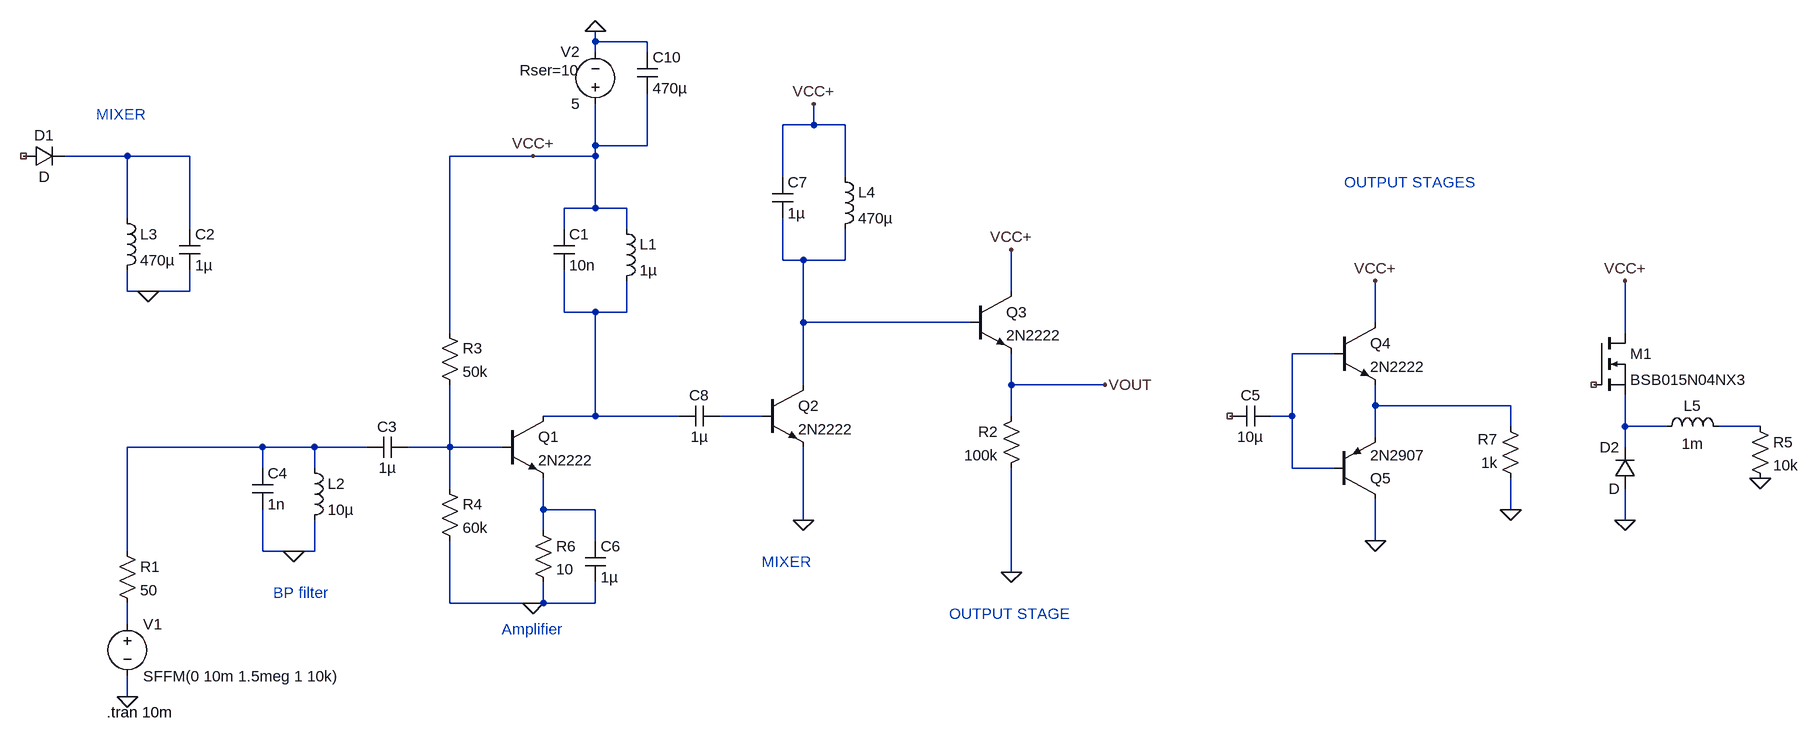
[diagram p0: schematic slope-detector.asc]
slope-detector.asc, the LTspice schematic file:
Version 4
SHEET 1 2260 888
WIRE 192 -608 192 -624
WIRE 272 -608 192 -608
WIRE 192 -592 192 -608
WIRE 272 -592 272 -608
WIRE 528 -480 528 -512
WIRE 528 -480 480 -480
WIRE 576 -480 528 -480
WIRE 192 -448 192 -512
WIRE 272 -448 272 -528
WIRE 272 -448 192 -448
WIRE -528 -432 -624 -432
WIRE -432 -432 -528 -432
WIRE 96 -432 -32 -432
WIRE 192 -432 192 -448
WIRE 192 -432 96 -432
WIRE 480 -400 480 -480
WIRE 576 -400 576 -480
WIRE 192 -352 192 -432
WIRE 192 -352 144 -352
WIRE 240 -352 192 -352
WIRE -528 -336 -528 -432
WIRE -432 -320 -432 -432
WIRE 144 -320 144 -352
WIRE 240 -320 240 -352
WIRE 480 -272 480 -336
WIRE 512 -272 480 -272
WIRE 576 -272 576 -320
WIRE 576 -272 512 -272
WIRE -528 -224 -528 -256
WIRE -496 -224 -528 -224
WIRE -432 -224 -432 -256
WIRE -432 -224 -496 -224
WIRE 832 -224 832 -288
WIRE 144 -192 144 -256
WIRE 192 -192 144 -192
WIRE 240 -192 240 -240
WIRE 240 -192 192 -192
WIRE 512 -176 512 -272
WIRE 768 -176 512 -176
WIRE 1392 -176 1392 -240
WIRE -32 -160 -32 -432
WIRE 1776 -160 1776 -240
WIRE 1328 -128 1264 -128
WIRE 512 -80 512 -176
WIRE 832 -80 832 -128
WIRE 976 -80 832 -80
WIRE 1392 -48 1392 -80
WIRE 1600 -48 1392 -48
WIRE 192 -32 192 -192
WIRE 192 -32 112 -32
WIRE 320 -32 192 -32
WIRE 448 -32 384 -32
WIRE 832 -32 832 -80
WIRE 1264 -32 1264 -128
WIRE 1264 -32 1232 -32
WIRE 1600 -16 1600 -48
WIRE 1776 -16 1776 -64
WIRE 1840 -16 1776 -16
WIRE 1984 -16 1920 -16
WIRE 1392 0 1392 -48
WIRE -320 16 -528 16
WIRE -240 16 -320 16
WIRE -160 16 -240 16
WIRE -32 16 -32 -80
WIRE -32 16 -96 16
WIRE 48 16 -32 16
WIRE 1776 16 1776 -16
WIRE -320 48 -320 16
WIRE -240 48 -240 16
WIRE 1264 48 1264 -32
WIRE 1328 48 1264 48
WIRE -32 80 -32 16
WIRE 112 112 112 64
WIRE 192 112 112 112
WIRE 1600 112 1600 64
WIRE 512 128 512 16
WIRE 1776 128 1776 80
WIRE 112 144 112 112
WIRE 192 160 192 112
WIRE 1392 160 1392 96
WIRE -528 176 -528 16
WIRE -320 176 -320 112
WIRE -272 176 -320 176
WIRE -240 176 -240 128
WIRE -240 176 -272 176
WIRE 832 208 832 48
WIRE -32 256 -32 160
WIRE 96 256 -32 256
WIRE 112 256 112 224
WIRE 112 256 96 256
WIRE 192 256 192 224
WIRE 192 256 112 256
WIRE -528 288 -528 256
WIRE -528 400 -528 368
FLAG -528 400 0
FLAG 96 256 0
FLAG 96 -432 VCC+
FLAG -272 176 0
FLAG 192 -624 0
FLAG -496 -224 0
FLAG 528 -512 VCC+
FLAG 832 -288 VCC+
FLAG 512 128 0
FLAG 1776 128 0
FLAG 1776 -240 VCC+
FLAG 832 208 0
FLAG 1984 64 0
FLAG 1600 112 0
FLAG 1392 -240 VCC+
FLAG 1392 160 0
FLAG 976 -80 VOUT
SYMBOL cap 128 -320 R0
SYMATTR InstName C1
SYMATTR Value 10n
SYMBOL ind 224 -336 R0
SYMATTR InstName L1
SYMATTR Value 1µ
SYMBOL voltage -528 272 R0
WINDOW 123 0 0 Left 0
WINDOW 39 0 0 Left 0
SYMATTR InstName V1
SYMATTR Value SFFM(0 10m 1.5meg 1 10k)
SYMBOL res -544 160 R0
SYMATTR InstName R1
SYMATTR Value 50
SYMBOL cap -448 -320 R0
SYMATTR InstName C2
SYMATTR Value 1µ
SYMBOL res -48 -176 R0
SYMATTR InstName R3
SYMATTR Value 50k
SYMBOL res -48 64 R0
SYMATTR InstName R4
SYMATTR Value 60k
SYMBOL cap -96 0 R90
WINDOW 0 0 32 VBottom 2
WINDOW 3 32 32 VTop 2
SYMATTR InstName C3
SYMATTR Value 1µ
SYMBOL npn 48 -32 R0
SYMATTR InstName Q1
SYMATTR Value 2N2222
SYMBOL cap -336 48 R0
SYMATTR InstName C4
SYMATTR Value 1n
SYMBOL ind -256 32 R0
SYMATTR InstName L2
SYMATTR Value 10µ
SYMBOL voltage 192 -496 R180
WINDOW 0 24 96 Left 2
WINDOW 3 24 16 Left 2
WINDOW 123 0 0 Left 0
WINDOW 39 24 68 Left 2
SYMATTR InstName V2
SYMATTR Value 5
SYMATTR SpiceLine Rser=10
SYMBOL res 96 128 R0
SYMATTR InstName R6
SYMATTR Value 10
SYMBOL cap 176 160 R0
SYMATTR InstName C6
SYMATTR Value 1µ
SYMBOL diode -688 -416 R270
WINDOW 0 32 32 VTop 2
WINDOW 3 0 32 VBottom 2
SYMATTR InstName D1
SYMBOL ind -544 -352 R0
SYMATTR InstName L3
SYMATTR Value 470µ
SYMBOL cap 256 -592 R0
SYMATTR InstName C10
SYMATTR Value 470µ
SYMBOL cap 384 -48 R90
WINDOW 0 0 32 VBottom 2
WINDOW 3 32 32 VTop 2
SYMATTR InstName C8
SYMATTR Value 1µ
SYMBOL npn 448 -80 R0
SYMATTR InstName Q2
SYMATTR Value 2N2222
SYMBOL cap 464 -400 R0
SYMATTR InstName C7
SYMATTR Value 1µ
SYMBOL ind 560 -416 R0
SYMATTR InstName L4
SYMATTR Value 470µ
SYMBOL npn 768 -224 R0
SYMATTR InstName Q3
SYMATTR Value 2N2222
SYMBOL res 848 -48 M0
SYMATTR InstName R2
SYMATTR Value 100k
SYMBOL nmos 1728 -160 R0
SYMATTR InstName M1
SYMATTR Value BSB015N04NX3
SYMBOL diode 1792 80 R180
WINDOW 0 24 64 Left 2
WINDOW 3 24 0 Left 2
SYMATTR InstName D2
SYMBOL res 1968 -32 R0
SYMATTR InstName R5
SYMATTR Value 10k
SYMBOL npn 1328 -176 R0
SYMATTR InstName Q4
SYMATTR Value 2N2222
SYMBOL pnp 1328 96 M180
SYMATTR InstName Q5
SYMATTR Value 2N2907
SYMBOL res 1616 80 R180
WINDOW 0 36 76 Left 2
WINDOW 3 36 40 Left 2
SYMATTR InstName R7
SYMATTR Value 1k
SYMBOL cap 1232 -48 R90
WINDOW 0 0 32 VBottom 2
WINDOW 3 32 32 VTop 2
SYMATTR InstName C5
SYMATTR Value 10µ
SYMBOL ind 1824 0 R270
WINDOW 0 32 56 VTop 2
WINDOW 3 5 56 VBottom 2
SYMATTR InstName L5
SYMATTR Value 1m
TEXT -560 424 Left 2 !.tran 10m
TEXT 48 296 Left 2 ;Amplifier
TEXT -304 240 Left 2 ;BP filter
TEXT 1344 -392 Left 2 ;OUTPUT STAGES
TEXT -576 -496 Left 2 ;MIXER
TEXT 448 192 Left 2 ;MIXER
TEXT 736 272 Left 2 ;OUTPUT STAGE

The netlist it stands for:
* slope-detector.asc
C1 VCC+ N003 10n
L1 VCC+ N003 1µ
V1 N012 0 SFFM(0 10m 1.5meg 1 10k)
R1 N009 N012 50
C2 N001 0 1µ
R3 VCC+ N010 50k
R4 N010 0 60k
C3 N010 N009 1µ
Q1 N003 N010 N011 0 2N2222
C4 N009 0 1n
L2 N009 0 10µ
V2 VCC+ 0 5 Rser=10
R6 N011 0 10
C6 N011 0 1µ
D1 NC_01 N001 D
L3 N001 0 470µ
C10 0 VCC+ 470µ
C8 N006 N003 1µ
Q2 N002 N006 0 0 2N2222
C7 VCC+ N002 1µ
L4 VCC+ N002 470µ
Q3 VCC+ N002 VOUT 0 2N2222
R2 VOUT 0 100k
M1 VCC+ NC_02 N007 N007 BSB015N04NX3
D2 0 N007 D
R5 N008 0 10k
Q4 VCC+ N004 N005 0 2N2222
Q5 0 N004 N005 0 2N2907
R7 0 N005 1k
C5 N004 NC_03 10µ
L5 N007 N008 1m
.model D D
.lib standard.dio
.model NPN NPN
.model PNP PNP
.lib standard.bjt
.model NMOS NMOS
.model PMOS PMOS
.lib standard.mos
.tran 10m
* Amplifier
* BP filter
* OUTPUT STAGES
* MIXER
* MIXER
* OUTPUT STAGE
.backanno
.end